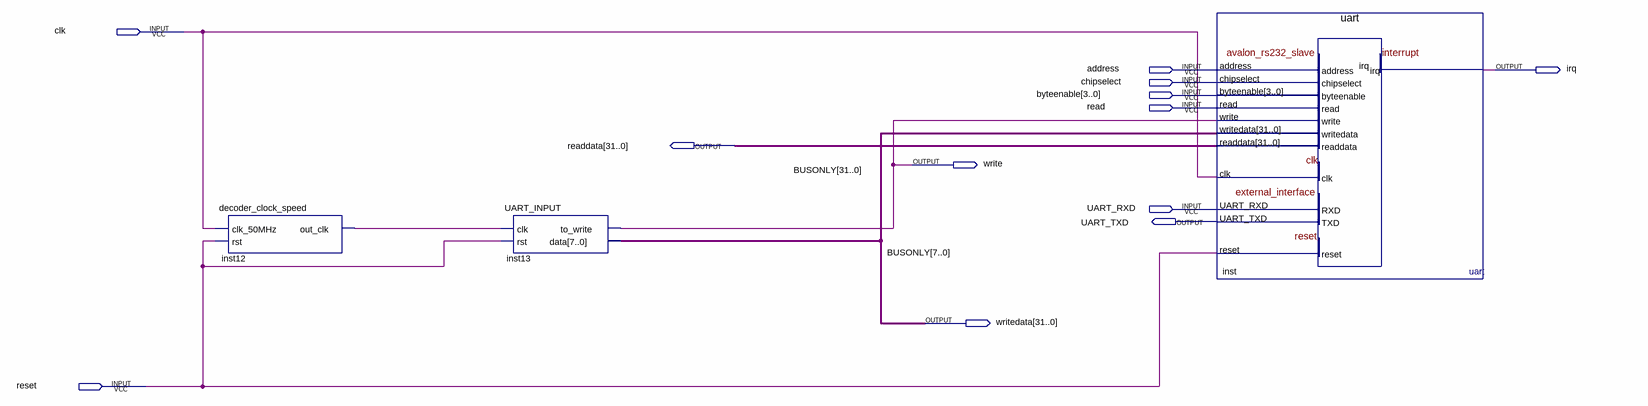
[diagram p0: schematic sheet]
// Quartus schematic uart_embedded.bdf as structural Verilog: 3 symbols, 12 pins
module uart_embedded (
  input  clk,
  input  address,
  input  chipselect,
  input  [3:0] byteenable,
  input  read,
  input  UART_RXD,
  input  reset,
  output irq,
  output [31:0] readdata,
  output write,
  output UART_TXD,
  output [31:0] writedata
);

  wire inst12_out_clk;

  decoder_clock_speed inst12 (.clk_50MHz(clk), .rst(reset), .out_clk(inst12_out_clk));
  UART_INPUT inst13 (.clk(inst12_out_clk), .rst(reset), .to_write(write), .data(writedata[7:0]));
  uart inst (
    .address(address), .chipselect(chipselect), .byteenable(byteenable), .read(read), .write(write),
    .writedata(writedata), .clk(clk), .UART_RXD(UART_RXD), .reset(reset), .readdata(readdata),
    .UART_TXD(UART_TXD), .irq(irq));

  // Other names for the same wires on the sheet: BUSONLY[31:0] = writedata
endmodule
